# EAGLE design open-bldc-logic (EAGLE 6.2)
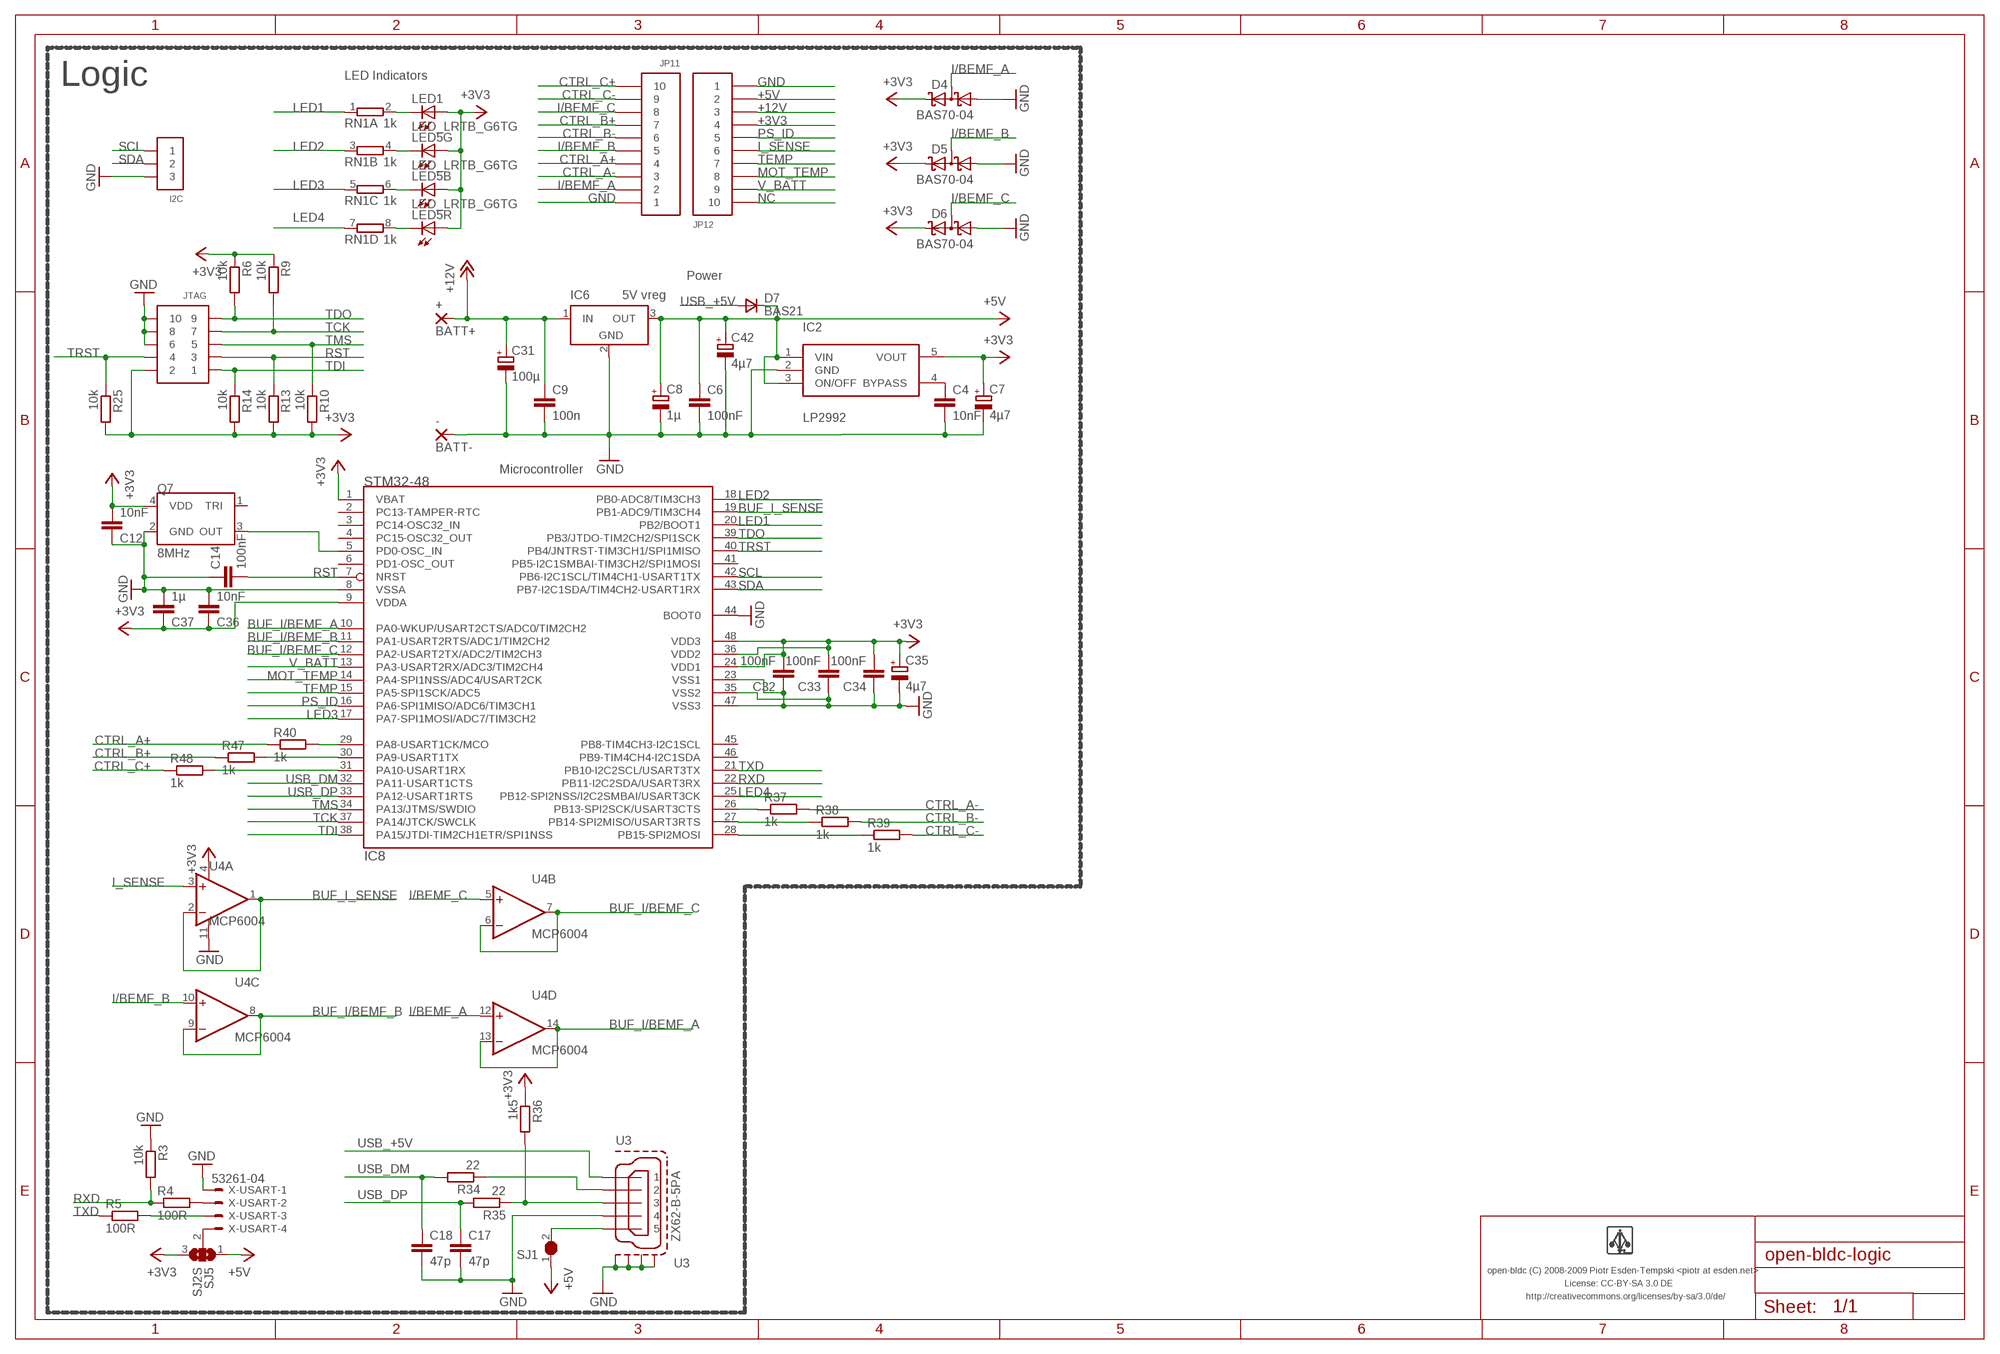
[diagram p0: schematic, sheet 1]

## Parts
+  BATT+  SMD5  [SMD2,54-5,08]
-  BATT-  SMD5  [SMD2,54-5,08]
C4  10nF  C-EUC0603  [C0603]
C6  100nF  C-EUC0603  [C0603]
C7  4µ7  CPOL-EUA/3216-18R  [A/3216-18R]
C8  1µ  CPOL-EUA/3216-18R  [A/3216-18R]
C9  100n  C-EUC0603  [C0603]
C12  10nF  C-EUC0603  [C0603]
C14  100nF  C-EUC0603  [C0603]
C17  47p  C-EUC0603  [C0603]
C18  47p  C-EUC0603  [C0603]
C31  100µ  CPOL-EUD/7343-31R  [D/7343-31R]
C32  100nF  C-EUC0603  [C0603]
C33  100nF  C-EUC0603  [C0603]
C34  100nF  C-EUC0603  [C0603]
C35  4µ7  CPOL-EUA/3216-18R  [A/3216-18R]
C36  10nF  C-EUC0603  [C0603]
C37  1µ  C-EUC0603  [C0603]
C42  4µ7  CPOL-EUA/3216-18R  [A/3216-18R]
D4  BAS70-04  [SOT23]
D5  BAS70-04  [SOT23]
D6  BAS70-04  [SOT23]
D7  BAS21  VAR2SOT23  [SOT-23]
I2C  PIN_HDR_EDG_1.27MM_3-1  [PIN_HDR_EDG_1.27MM_3-1]
IC2  LP2992  [SOT23-5]
IC6  5V vreg  LT1129CST5  [SOT223]
IC8  STM32-48  [LQFP48]
JP11  PIN_HDR_1.27MM_10  PIN_HDR_1.27MM_10_TH  [PIN_HDR_1.27MM_10]
JP12  PIN_HDR_1.27MM_10  PIN_HDR_1.27MM_10_TH  [PIN_HDR_1.27MM_10]
JTAG  PIN_HDR_EDG_1.27MM_5-2  [PIN_HDR_EDG_1.27MM_5-2]
LED1  AMBER  LEDCHIP-LED0603  [CHIP-LED0603]
LED5  LED_LRTB_G6TG  [PLCC6]
Q7  8MHz  ASE_ASCILLATOR  [ASE_OSCILLATOR]
R3  10k  R-EU_R0603  [R0603]
R4  100R  R-EU_R0603  [R0603]
R5  100R  R-EU_R0603  [R0603]
R6  10k  R-EU_R0603  [R0603]
R9  10k  R-EU_R0603  [R0603]
R10  10k  R-EU_R0603  [R0603]
R13  10k  R-EU_R0603  [R0603]
R14  10k  R-EU_R0603  [R0603]
R25  10k  R-EU_R0603  [R0603]
R34  22  R-EU_R0603  [R0603]
R35  22  R-EU_R0603  [R0603]
R36  1k5  R-EU_R0603  [R0603]
R37  1k  R-EU_R0603  [R0603]
R38  1k  R-EU_R0603  [R0603]
R39  1k  R-EU_R0603  [R0603]
R40  1k  R-EU_R0603  [R0603]
R47  1k  R-EU_R0603  [R0603]
R48  1k  R-EU_R0603  [R0603]
RN1  1k  R4N1206  [R4N1206]
SJ1  SJ1S  [SJ1S]
SJ5  SJ2S  [SJ2S]
U3  ZX62-B-5PA  [ZX62-B-5PA]
U4  MCP6004  [TSSOP_14]
X-USART  53261-04  [53261-04]

## Nets
+3V3: C7.+ C12.2 C32.2 C33.2 C34.2 C35.+ C36.1 C37.1 D4.2(C2) D5.2(C2) D6.2(C2) IC2.5(VOUT) IC8.1(VBAT) IC8.9(VDDA) IC8.24(VDD1) IC8.36(VDD2) IC8.48(VDD3) JP12.P$4 JTAG.P$2 LED1.A LED5.A1(R:A) LED5.A2(G:A) LED5.A3(B:A) Q7.4(VDD) R6.1 R9.1 R10.2 R13.2 R14.2 R25.2 R36.1 SJ5.3 U4.4(A:V+)
+5V: C6.1 C8.+ C42.+ D7.1(C) IC2.1(VIN) IC2.3(ON/OFF) IC6.3(OUT) JP12.P$2 SJ1.1 SJ5.1
+12V: +.1(P) C9.1 C31.+ IC6.1(IN) JP12.P$3
BUF_I/BEMF_A: IC8.10(PA0-WKUP/USART2CTS/ADC0/TIM2CH2) U4.13(D:-IN) U4.14(D:OUT)
BUF_I/BEMF_B: IC8.11(PA1-USART2RTS/ADC1/TIM2CH2) U4.8(C:OUT) U4.9(C:-IN)
BUF_I/BEMF_C: IC8.12(PA2-USART2TX/ADC2/TIM2CH3) U4.6(B:-IN) U4.7(B:OUT)
BUF_I_SENSE: IC8.19(PB1-ADC9/TIM3CH4) U4.1(A:OUT) U4.2(A:-IN)
CTRL_A+: JP11.P$4 R40.1
CTRL_A-: JP11.P$3 R37.2
CTRL_B+: JP11.P$7 R47.1
CTRL_B-: JP11.P$6 R38.2
CTRL_C+: JP11.P$10 R48.1
CTRL_C-: JP11.P$9 R39.2
GND: -.1(P) C4.2 C6.2 C7.- C8.- C9.2 C12.1 C14.1 C17.2 C18.2 C31.- C32.1 C33.1 C34.1 C35.- C36.2 C37.2 C42.- D4.1(A1) D5.1(A1) D6.1(A1) I2C.P$3 IC2.2(GND) IC6.2(GND) IC8.8(VSSA) IC8.23(VSS1) IC8.35(VSS2) IC8.44(BOOT0) IC8.47(VSS3) JP11.P$1 JP12.P$1 JTAG.P$6 JTAG.P$8 JTAG.P$10 Q7.2(GND) R3.1 U3.GND_LEFT(S1) U3.GND_RIGHT(S2) U3.GND_UP_LEFT(S3) U3.GND_UP_RIGHT(S4) U3.PIN_4 U4.11(A:V-) X-USART.1
I/BEMF_A: D4.3(C1A2) JP11.P$2 U4.12(D:+IN)
I/BEMF_B: D5.3(C1A2) JP11.P$5 U4.10(C:+IN)
I/BEMF_C: D6.3(C1A2) JP11.P$8 U4.5(B:+IN)
I_SENSE: JP12.P$6 U4.3(A:+IN)
LED1: IC8.20(PB2/BOOT1) RN1.1
LED2: IC8.18(PB0-ADC8/TIM3CH3) RN1.3
LED3: IC8.17(PA7-SPI1MOSI/ADC7/TIM3CH2) RN1.5
LED4: IC8.25(PB12-SPI2NSS/I2C2SMBAI/USART3CK) RN1.7
MOT_TEMP: IC8.14(PA4-SPI1NSS/ADC4/USART2CK) JP12.P$8
N$1: IC8.29(PA8-USART1CK/MCO) R40.2
N$2: LED5.C1(R:C) RN1.8
N$3: LED1.C RN1.2
N$4: LED5.C3(B:C) RN1.6
N$5: LED5.C2(G:C) RN1.4
N$6: IC8.26(PB13-SPI2SCK/USART3CTS) R37.1
N$8: SJ5.2 X-USART.4
N$9: R4.2 X-USART.2
N$20: R5.2 X-USART.3
N$22: C4.1 IC2.4(BYPASS)
N$25: R34.1 U3.PIN_2
N$26: SJ1.2 U3.PIN_5
N$28: R35.1 R36.2 U3.PIN_3
N$36: IC8.27(PB14-SPI2MISO/USART3RTS) R38.1
N$39: IC8.28(PB15-SPI2MOSI) R39.1
N$40: IC8.5(PD0-OSC_IN) Q7.3(OUT)
N$42: IC8.30(PA9-USART1TX) R47.2
N$45: IC8.31(PA10-USART1RX) R48.2
NC: JP12.P$10
PS_ID: IC8.16(PA6-SPI1MISO/ADC6/TIM3CH1) JP12.P$5
RST: C14.2 IC8.7(NRST) JTAG.P$3 R13.1
RXD: IC8.22(PB11-I2C2SDA/USART3RX) R3.2 R4.1
SCL: I2C.P$1 IC8.42(PB6-I2C1SCL/TIM4CH1-USART1TX)
SDA: I2C.P$2 IC8.43(PB7-I2C1SDA/TIM4CH2-USART1RX)
TCK: IC8.37(PA14/JTCK/SWCLK) JTAG.P$7 R9.2
TDI: IC8.38(PA15/JTDI-TIM2CH1ETR/SPI1NSS) JTAG.P$1 R14.1
TDO: IC8.39(PB3/JTDO-TIM2CH2/SPI1SCK) JTAG.P$9 R6.2
TEMP: IC8.15(PA5-SPI1SCK/ADC5) JP12.P$7
TMS: IC8.34(PA13/JTMS/SWDIO) JTAG.P$5 R10.1
TRST: IC8.40(PB4/JNTRST-TIM3CH1/SPI1MISO) JTAG.P$4 R25.1
TXD: IC8.21(PB10-I2C2SCL/USART3TX) R5.1
USB_+5V: D7.3(A) U3.PIN_1
USB_DM: C18.1 IC8.32(PA11-USART1CTS) R34.2
USB_DP: C17.1 IC8.33(PA12-USART1RTS) R35.2
V_BATT: IC8.13(PA3-USART2RX/ADC3/TIM2CH4) JP12.P$9
Unconnected: IC8.2(PC13-TAMPER-RTC) IC8.3(PC14-OSC32_IN) IC8.4(PC15-OSC32_OUT) IC8.6(PD1-OSC_OUT) IC8.41(PB5-I2C1SMBAI-TIM3CH2/SPI1MOSI) IC8.45(PB8-TIM4CH3-I2C1SCL) IC8.46(PB9-TIM4CH4-I2C1SDA) Q7.1(TRI)

## Notes on the sheet
- LED Indicators
- Logic
- Power
- Microcontroller
- open-bldc (C) 2008-2009 Piotr Esden-Tempski <piotr at esden.net>
- License: CC-BY-SA 3.0 DE
- http://creativecommons.org/licenses/by-sa/3.0/de/

## Power pins joined to a net without a drawn wire
GND: IC6.4(GND)

## Library data of the parts
+ - = wirepad:SMD5: SMD PAD
C4 C6 C9 C12 C14 C17 C18 C32-C34 C36 C37 = rcl:C-EU: CAPACITOR, European symbol
C7 C8 C31 C35 C42 = rcl:CPOL-EU: POLARIZED CAPACITOR, European symbol
D4-D6 = diode:BAS70-04: Silicon Schottky Diodes General-purpose diode for high-speed switching
D7 = zetex:VAR2SOT23: DIODE
I2C = open-bldc:PIN_HDR_EDG_1.27MM_3-1
IC2 = open-bldc:LP2992
IC6 = linear-technology:LT1129CST5: VOLTAGE REGULATOR with shutdown
IC8 = open-bldc:STM32-48
JP11 JP12 = open-bldc:PIN_HDR_1.27MM_10
JTAG = open-bldc:PIN_HDR_EDG_1.27MM_5-2
LED1 = led:LED: LED OSRAM: - CHIPLED LG R971, LG N971, LY N971, LG Q971, LY Q971, LO R971, LY R971 LH N974, LH R974 LS Q976, LO Q976, LY Q976 LO Q996 - Hyper CHIPLED LW Q18S LB Q993, LB Q99A, LB R99A - SideLED LS A670, LO A670, LY A670, LG A670, LP A670 LB A673, LV A673, LT A673, LW A673 LH A674 LY A675 LS A676, LA A676, LO A676, LY A676, LW A676 LS A679, LY A679, LG A679 - Hyper Micro SIDELED® LS Y876, LA Y876, LO Y876, LY Y876 LT Y87S - SmartLED LW L88C, LW L88S LB L89C, LB L89S, LG L890 LS L89K, LO L89K, LY L89K LS L896, LA L896, LO L896, LY L896 - TOPLED LS T670, LO T670, LY T670, LG T670, LP T670 LSG T670, LSP T670, LSY T670, LOP T670, LYG T670 LG T671, LOG T671, LSG T671 LB T673, LV T673, LT T673, LW T673 LH T674 LS T676, LA T676, LO T676, LY T676, LB T676, LH T676, LSB T676, LW T676 LB T67C, LV T67C, LT T67C, LS T67K, LO T67K, LY T67K, LW E67C LS E67B, LA E67B, LO E67B, LY E67B, LB E67C, LV E67C, LT E67C LW T67C LS T679, LY T679, LG T679 LS T770, LO T770, LY T770, LG T770, LP T770 LB T773, LV T773, LT T773, LW T773 LH T774 LS E675, LA E675, LY E675, LS T675 LS T776, LA T776, LO T776, LY T776, LB T776 LHGB T686 LT T68C, LB T68C - Hyper Mini TOPLED® LB M676 - Mini TOPLED Santana® LG M470 LS M47K, LO M47K, LY M47K Source: http://www.osram.convergy.de LUXEON: - LUMILED® LXK2-PW12-R00, LXK2-PW12-S00, LXK2-PW14-U00, LXK2-PW14-V00 LXK2-PM12-R00, LXK2-PM12-S00, LXK2-PM14-U00 LXK2-PE12-Q00, LXK2-PE12-R00, LXK2-PE12-S00, LXK2-PE14-T00, LXK2-PE14-U00 LXK2-PB12-K00, LXK2-PB12-L00, LXK2-PB12-M00, LXK2-PB14-N00, LXK2-PB14-P00, LXK2-PB14-Q00 LXK2-PR12-L00, LXK2-PR12-M00, LXK2-PR14-Q00, LXK2-PR14-R00 LXK2-PD12-Q00, LXK2-PD12-R00, LXK2-PD12-S00 LXK2-PH12-R00, LXK2-PH12-S00 LXK2-PL12-P00, LXK2-PL12-Q00, LXK2-PL12-R00 Source: www.luxeon.com KINGBRIGHT: KA-3528ASYC Source: www.kingbright.com
LED5 = open-bldc:LED_LRTB_G6TG
Q7 = open-bldc:ASE_ASCILLATOR
R3-R6 R9 R10 R13 R14 R25 R34-R40 R47 R48 = rcl:R-EU_: RESISTOR, European symbol
RN1 = open-bldc:R4N1206
SJ1 = open-bldc:SJ1S
SJ5 = open-bldc:SJ2S
U3 = open-bldc:ZX62-B-5PA
U4 = open-bldc:MCP6004
X-USART = con-molex:53?-04: CONNECTOR wire to board 1.25 mm (.049 inch) pitch header

## Net classes
0 default: width 0.152 mm, drill 0.305 mm, clearance 0.152 mm

## Board
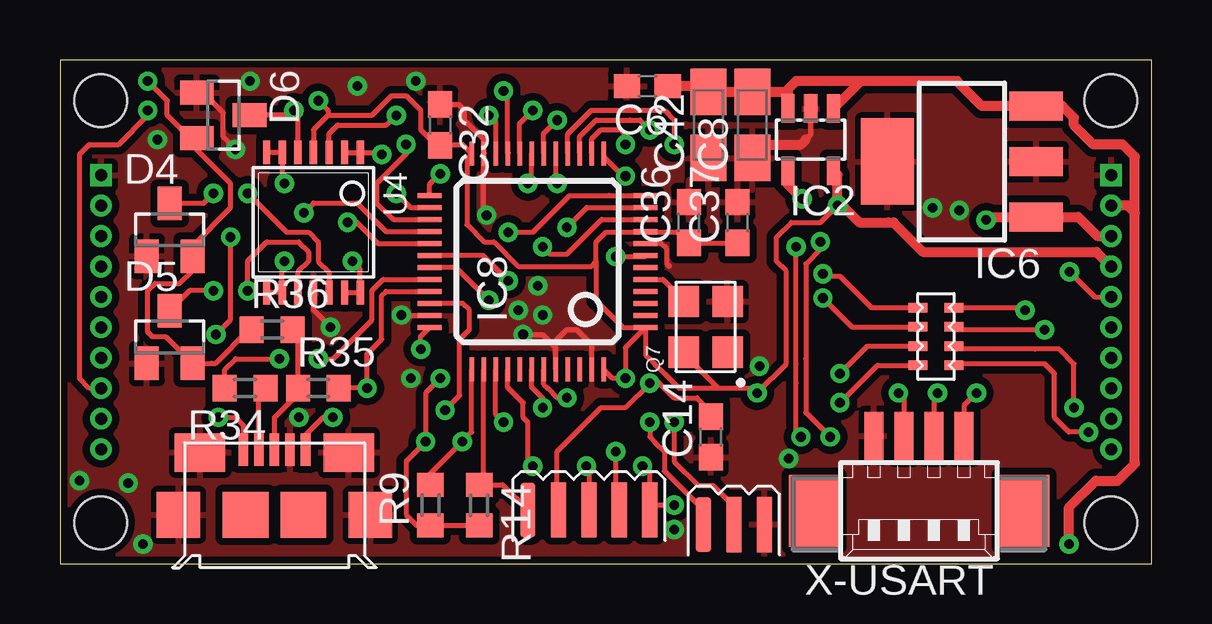
[diagram p1: board, top side]
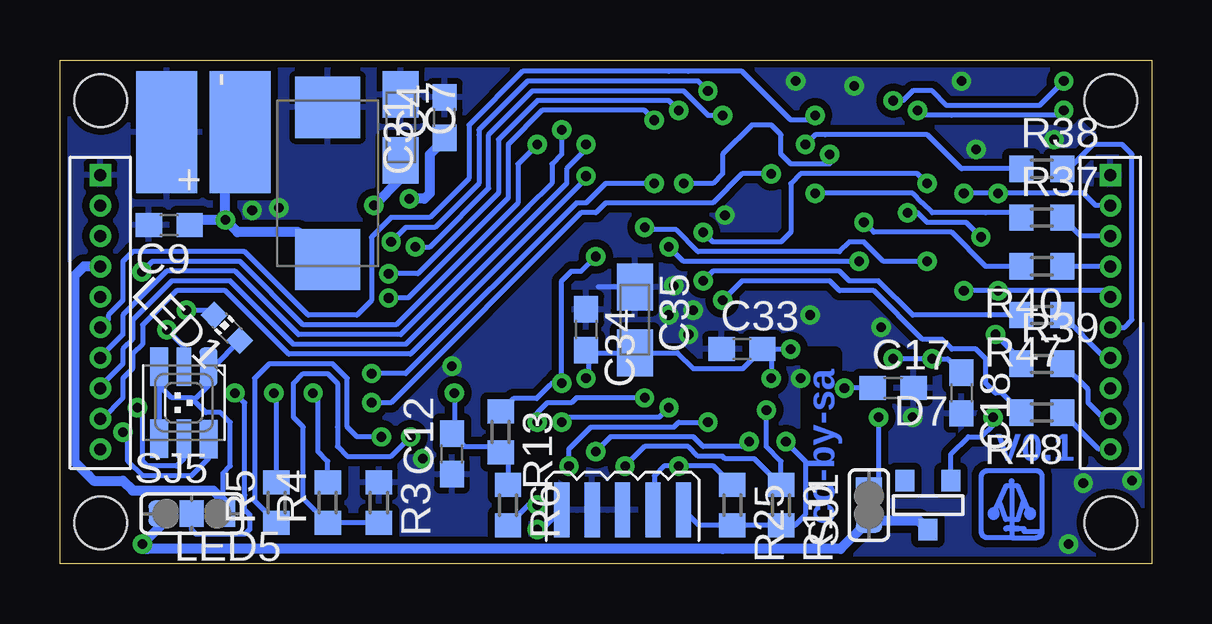
[diagram p2: board, bottom side, seen from below]

Size 45.5 x 21 mm. Coordinates in mm from the lower left corner, seen from the top.
Outline: 0,0 45.5,0 45.5,21 0,21 0,0
Copper layers (1*16): Top 0.035mm / dielectric 1.5mm / Bottom 0.035mm
Design rules: minimum track width 7mil, minimum drill 0.3mm, track to track 8mil, track to pad 8mil, pad to pad 8mil, via to via 8mil, smd to smd 8mil, copper to edge 10mil, drill to drill 8mil, minimum pad ring 8mil, minimum via ring 8mil, stop-mask expansion 4mil, vias tented up to drill 0.4mm, thermal gap 10mil
Holes 2.2 mm at 1.7,1.7 43.8,1.7 43.8,19.3 1.7,19.3

### Footprints (pad centres in the part's own frame; a part is rotated, then mirrored left to right if it is on the bottom)
SMD2,54-5,08 = smd 2.54 x 5.08: 1 0,0
C0603 = smd 1.1 x 1: 1 -0.85,0; 2 0.85,0
A/3216-18R = smd 1.95 x 1.5: + 1.375,0; - -1.375,0
D/7343-31R = smd 2.55 x 2.7: + 3.175,0; - -3.175,0
SOT23 = smd 1 x 1.4: 1 -0.95,-1.1; 2 0.95,-1.1; 3 0,1.1
SOT-23 = smd 0.787 x 0.889: 1 0.025,-1.016; 2 -0.94,1.016; 3 0.991,1.016
PIN_HDR_EDG_1.27MM_3-1 = smd 2.3 x 0.635: P$1 0,0; P$2 0,1.27; P$3 0,2.54
SOT23-5 = smd 0.55 x 1.2: 1 -0.95,-1.3; 2 0,-1.3; 3 0.95,-1.3; 4 0.95,1.3; 5 -0.95,1.3
SOT223 = smd 1.219 x 2.235: 1 -2.311,-3.099; 2 0,-3.099; 3 2.311,-3.099 | smd 3.6 x 2.2: 4 0,3.099
LQFP48 = smd 0.2 x 1: 1 -2.75,-4.5; 2 -2.25,-4.5; 3 -1.75,-4.5; 4 -1.25,-4.5; 5 -0.75,-4.5; 6 -0.25,-4.5; 7 0.25,-4.5; 8 0.75,-4.5; 9 1.25,-4.5; 10 1.75,-4.5; 11 2.25,-4.5; 12 2.75,-4.5; 25 2.75,4.5; 26 2.25,4.5; 27 1.75,4.5; 28 1.25,4.5; 29 0.75,4.5; 30 0.25,4.5; 31 -0.25,4.5; 32 -0.75,4.5; 33 -1.25,4.5; 34 -1.75,4.5; 35 -2.25,4.5; 36 -2.75,4.5 | smd 1 x 0.2: 13 4.5,-2.75; 14 4.5,-2.25; 15 4.5,-1.75; 16 4.5,-1.25; 17 4.5,-0.75; 18 4.5,-0.25; 19 4.5,0.25; 20 4.5,0.75; 21 4.5,1.25; 22 4.5,1.75; 23 4.5,2.25; 24 4.5,2.75; 37 -4.5,2.75; 38 -4.5,2.25; 39 -4.5,1.75; 40 -4.5,1.25; 41 -4.5,0.75; 42 -4.5,0.25; 43 -4.5,-0.25; 44 -4.5,-0.75; 45 -4.5,-1.25; 46 -4.5,-1.75; 47 -4.5,-2.25; 48 -4.5,-2.75
PIN_HDR_1.27MM_10 = drill 0.5 square: P$1 0,0 | drill 0.5: P$2 0,1.27; P$3 0,2.54; P$4 0,3.81; P$5 0,5.08; P$6 0,6.35; P$7 0,7.62; P$8 0,8.89; P$9 0,10.16; P$10 0,11.43
PIN_HDR_EDG_1.27MM_5-2 = smd 2.3 x 0.635: P$1 0,0; P$3 0,1.27; P$5 0,2.54; P$7 0,3.81; P$9 0,5.08 | smd 2.3 x 0.635 bottom: P$2 0,0; P$4 0,1.27; P$6 0,2.54; P$8 0,3.81; P$10 0,5.08
CHIP-LED0603 = smd 0.8 x 0.8: A 0,-0.75; C 0,0.75
PLCC6 = smd 0.75 x 1.6: A1 -1.025,-1.5; A2 1.025,-1.5; A3 1.025,1.5; C1 -1.025,1.525 | smd 0.6 x 1.6: C2 0,-1.5; C3 0,1.5
ASE_OSCILLATOR = smd 1.295 x 1.27: 1 -1.041,-0.902; 2 1.067,-0.902; 3 1.067,0.927; 4 -1.041,0.927
R0603 = smd 1 x 1.1: 1 -0.85,0; 2 0.85,0
R4N1206 = smd 0.4 x 0.8: 1 0,0; 2 0,1.5; 3 0.8,0; 4 0.8,1.5; 5 1.6,0; 6 1.6,1.5; 7 2.4,0; 8 2.4,1.5
SJ1S = smd 1 x 1.1: 1 -0.65,-0.005; 2 0.65,-0.005
SJ2S = smd 1 x 1.1: 1 -1.3,0; 2 0,0; 3 1.3,0
ZX62-B-5PA = smd 1.8 x 1.9: GND_LEFT -4,0; GND_RIGHT 4,0 | smd 1.9 x 1.9: GND_MID_LEFT -1.2,0; GND_MID_RIGHT 1.2,0 | smd 2.1 x 1.6: GND_UP_LEFT -3.1,2.6; GND_UP_RIGHT 3.1,2.6 | smd 0.4 x 1.35: PIN_1 -1.3,2.725; PIN_2 -0.65,2.725; PIN_3 0,2.725; PIN_4 0.65,2.725; PIN_5 1.3,2.725
TSSOP_14 = smd 0.305 x 0.991: 1 -1.95,-2.918; 2 -1.3,-2.918; 3 -0.65,-2.918; 4 0,-2.918; 5 0.65,-2.918; 6 1.3,-2.918; 7 1.95,-2.918; 8 1.95,2.918; 9 1.3,2.918; 10 0.65,2.918; 11 0,2.918; 12 -0.65,2.918; 13 -1.3,2.918; 14 -1.95,2.918
53261-04 = smd 0.8 x 2: 1 1.875,-2.5; 2 0.625,-2.5; 3 -0.625,-2.5; 4 -1.875,-2.5 | smd 2.1 x 3: S1 4.375,0.625; S2 -4.375,0.625

### Placement (x,y rotation side)
+  38,17.98 0 bottom
-  41.05,17.98 180 bottom
C4  29.46,18.59 90 bottom
C6  24.49,19.91 180 top
C7  31.29,18.19 270 bottom
C8  28.85,18.29 90 top
C9  40.94,14.12 180 bottom
C12  29.16,4.57 90 bottom
C14  27.13,5.28 90 top
C17  10.77,7.32 0 bottom
C18  7.92,7.11 270 bottom
C31  34.34,15.85 270 bottom
C32  15.85,18.29 270 top
C33  17.07,8.94 0 bottom
C34  23.57,9.75 270 bottom
C35  21.54,10.16 270 bottom
C36  26.21,14.22 90 top
C37  28.24,14.22 90 top
C42  27.03,18.29 90 top
D4  4.57,13.92 0 top
D5  4.57,9.45 0 top
D6  6.81,18.69 270 top
D7  9.35,2.44 0 bottom
I2C  26.82,1.63 270 top
IC2  31.29,17.68 180 top
IC6  37.59,16.76 90 top
IC8  19.91,12.6 90 top
JP11  1.71,16.2 180 bottom
JP12  43.81,16.2 180 bottom
JTAG  19.51,2.24 270 top
LED1  38.54,9.83 45 bottom
LED5  40.34,6.71 180 bottom
Q7  26.92,9.86 90 top
R3  32.21,2.54 270 bottom
R4  34.34,2.54 90 bottom
R5  36.47,2.54 90 bottom
R6  26.82,2.44 270 bottom
R9  15.44,2.44 90 top
R10  15.44,2.44 270 bottom
R13  27.13,5.49 270 bottom
R14  17.48,2.44 270 top
R25  17.48,2.44 270 bottom
R34  7.72,7.32 180 top
R35  10.77,7.32 0 top
R36  8.84,9.75 0 top
R37  4.57,14.43 0 bottom
R38  4.57,16.46 0 bottom
R39  4.57,8.33 0 bottom
R40  4.57,12.4 180 bottom
R47  4.57,10.36 180 bottom
R48  4.57,6.3 180 bottom
RN1  35.76,10.67 270 top
SJ1  11.79,2.44 90 bottom
SJ5  40.01,2.08 0 bottom
U3  8.94,2.03 0 top
U4  10.57,14.22 180 top
X-USART  35.81,2.83 180 top

### Tracks (layer width: path | path; a pad name or v marks a point on that pad's centre or on a via)
+3V3  (via drill 0.4)
  Top 0.203: IC8.48 23.04,7.72 v23.57,7.72 23.57,9.01 IC8.1 | v15.04,8.94 15.04,9.47 IC8.36 | IC8.1 24.41,8.71 24.59,8.53 24.79,8.33 25.2,7.92 25.4,7.72 25.81,7.32 27.43,7.32 | 27.43,7.32 28.85,7.32 v29.06,7.11 30.28,8.33 30.28,12.19 29.87,12.6 29.87,13.61 30.48,14.22 31.7,14.22 v32.41,14.94 | U4.4 10.57,18.09 11.18,18.69 | 11.18,18.69 13.01,18.69 13.82,19.51 14.43,19.51 15.04,18.9 15.04,18.09 15.68,17.44 C32.2 15.89,17.48 16.79,17.48 IC8.24 16.96,16.89 16.96,14.13 17.68,13.41 18.09,13.41 19.1,12.39 22.15,12.39 22.35,12.6 | v15.85,7.72 15.24,7.11 15.24,5.49 v15.24,5.08 14.43,4.27 14.43,2.03 14.87,1.59 R10.2 R25.2 | 27.43,7.32 26.4,8.34 26.4,8.41 Q7.4 | IC8.1 23.48,9.85 22.35,10.97 22.35,12.6 | 22.35,12.6 22.35,13.41 22.76,13.82 24.38,13.82 | 24.38,13.82 IC8.9 24.38,13.82 | v3.66,20.12 4.47,19.3 4.47,18.69 5.42,17.74 D6.2 5.71,17.25 5.89,17.07 7.11,15.85 7.11,14.83 5.52,13.24 D4.2 5.52,12.23 4.98,11.68 3.96,11.68 3.66,11.38 3.66,9.65 3.86,9.45 4.42,9.45 D5.2 6.32,8.35 6.48,8.35 7.89,9.75 R36.1 | v10.77,19.3 11.18,18.9 11.18,18.69 | 24.38,13.82 25.77,13.82 C36.1 C37.1
  Top 0.406: IC2.5 32.41,16.21 v32.41,14.94 32.61,14.94 33.33,14.22 34.54,14.22 34.75,14.22 35.97,13 43.2,13 JP12.P$4
  Bottom 0.203: JTAG.P$2 18.86,1.59 R25.2 R10.2 | 23.45,8.79 C34.2 | 23.45,8.79 C35.+ 19.76,8.79 19.1,8.13 17.03,8.13 C33.2 | 23.45,8.79 23.45,7.84 v23.57,7.72 | R10.2 15.07,1.22 | C33.2 v15.04,8.94 | v29.06,7.11 29.06,5.93 29.16,5.83 C12.2 28.65,4.91 28.65,4.88 27.94,4.88 27.37,4.88 R13.2 26.82,4.33 R6.1 27.13,3.59 | v15.24,5.08 14.43,4.27 14.43,2.03 14.87,1.59 R10.2 | C33.2 16.05,8.78 | v15.85,7.72 15.85,8.57 C33.2 | LED1.A 39.09,8.21 LED5.A1 39.31,7.43 39.83,6.91 40.03,6.91 | LED5.A3 LED5.A2 41.36,7.43 40.84,6.91 40.03,6.91 | 40.03,6.91 39.42,6.3 38.81,6.3 38.41,5.89 38.41,4.06 38.7,3.76 38.7,2.64 | v3.66,20.12 4.67,19.1 8.53,19.1 9.14,19.71 9.96,19.71 10.36,19.3 v10.77,19.3
  Bottom 0.406: C7.+ 31.29,16.05 v32.41,14.94 | JP12.P$4 44.51,12.39 44.91,11.99 44.91,4.27 44.3,3.66 44.09,3.45 42.88,3.45 42.47,3.05 39.11,3.05 38.7,2.64 SJ5.3
+5V  (via drill 0.4)
  Top 0.406: 33.73,20.12 37.39,20.12 38.43,19.07 IC6.3 41.78,19.07 42.27,18.59 42.27,18.29 43.08,17.48 44.3,17.48 44.81,16.97 44.81,14.63 | 33.73,20.12 33.38,20.12 IC2.1 | 30.34,19.78 IC2.3 | 30.34,19.78 30.68,20.12 33.73,20.12 | 44.81,14.63 44.5,14.94 44.5,14.93 JP12.P$2 | 44.81,14.63 44.81,4.17 44.3,3.66 44.09,3.45 43.18,3.45 42.06,2.34 v42.06,0.81 | C42.+ 26.64,20.05 | C6.1 26.77,19.91 C42.+ | C42.+ C8.+ 30.23,19.66 30.34,19.78
  Bottom 0.406: SJ5.1 41.3,1.57 v42.06,0.81 arc-90 41.86,0.61 17.88,0.61 12.96,0.61 SJ1.1 9.69,1.79 D7.1
+12V  (via drill 0.4)
  Top 0.406: JP12.P$3 43.24,13.66 42.44,14.45 IC6.1 38.73,14.45 v38.61,14.33
  Bottom 0.406: v38.61,14.33 38.1,13.82 35.56,13.82 34.42,12.68 C31.+ | v38.61,14.33 39.89,14.33 C9.1 | +.1 38.61,17.37 v38.61,14.33
BUF_I/BEMF_A  (via drill 0.4)
  Top 0.203: U4.13 U4.14 12.52,12.27 v12.19,12.6 | v20.12,13.21 20.42,12.9 21.13,12.9 22.58,14.35 IC8.10
  Bottom 0.203: v12.19,12.6 19.51,12.6 v20.12,13.21
BUF_I/BEMF_B  (via drill 0.4)
  Top 0.203: U4.8 U4.9 9.27,12.6 v9.35,12.6 | v21.13,14.02 21.96,14.85 IC8.11
  Bottom 0.203: v9.35,12.6 11.18,12.6 11.99,13.41 12.6,13.41 13.01,13.01 18.9,13.01 19.81,13.92 21.03,13.92 v21.13,14.02
BUF_I/BEMF_C  (via drill 0.4)
  Top 0.203: U4.7 U4.6 9.27,15.93 v9.35,15.85 | v18.69,13.82 19.71,13.82 21.23,15.34 22.86,15.34 22.87,15.35 IC8.12
  Bottom 0.203: v18.69,13.82 18.29,13.41 15.44,13.41 15.04,13.82 15.04,15.85 14.63,16.26 9.75,16.26 v9.35,15.85
BUF_I_SENSE  (via drill 0.4)
  Top 0.203: U4.2 U4.1 13.34,17.14 v13.41,17.07 | v19.51,15.85 19.66,16.01 IC8.19
  Bottom 0.203: v13.41,17.07 13.41,16.66 15.04,16.66 15.44,17.07 15.44,17.88 15.85,18.29 16.66,18.29 17.88,17.07 17.88,16.26 18.29,15.85 v19.51,15.85
CTRL_A+
  Bottom 0.203: JP11.P$4 R40.1
CTRL_A-
  Bottom 0.203: JP11.P$3 2.96,13.66 R37.2
CTRL_B+
  Bottom 0.203: JP11.P$7 1.94,8.58 R47.1
CTRL_B-
  Bottom 0.203: JP11.P$6 1.12,9.85 0.81,10.16 0.81,17.07 1.22,17.48 2.44,17.48 3.45,16.46 R38.2
CTRL_C+
  Bottom 0.203: JP11.P$10 2.19,4.77 R48.1
CTRL_C-
  Bottom 0.203: JP11.P$9 1.98,6.04 2.64,6.71 2.64,7.25 R39.2
GND  (via drill 0.4)
  Top 0.203: IC8.8 25.06,13.35 25.3,13.11 25.3,12.5 25.4,12.39 | IC8.23 17.68,17.1 | v19.3,9.55 20.12,9.55 20.66,9 IC8.44 20.66,9.28 21.13,9.75 21.54,9.75 22.16,9.13 IC8.47 | 31.09,17.68 31.29,17.88 IC2.2 | IC8.23 17.66,14.64 v17.78,14.53 | D6.1 5.96,19.64 6.81,18.8 6.81,17.78 v7.32,17.27 | C32.1 16.62,19.14 16.87,18.9 16.87,18.49 17.66,17.69 IC8.23 | IC8.35 14.24,10.35 v14.22,10.36 | v11.28,9.86 10.57,10.57 U4.11
  Top 0.406: 31.09,17.68 30.91,17.5 | C8.- 29.42,17.48 30.89,17.48
  Bottom 0.203: C35.- 23.06,11.54 | JTAG.P$10 25.4,1.42 v25.6,1.42
  other vias: 9.96,6.1 37.49,14.73 36.37,14.83 19.91,11.58 30.38,4.37 2.84,3.35 29.16,8.23 12.4,19.91 7.92,20.12 14.83,20.12 19.1,10.57 20.12,10.36 14.63,7.72 0.81,3.45 3.45,0.81 4.06,17.68
  pour Top (isolate 0.305): 45.21,20.88 0.1,20.85 0.1,0 45.21,0
  pour Bottom (isolate 0.305): 45.21,20.88 0.1,20.85 0.1,0 45.21,0
I/BEMF_A  (via drill 0.4)
  Top 0.203: U4.12 11.22,12.15 10.77,12.6 10.77,13.41 10.36,13.82 9.45,13.82 8.13,15.14 v7.82,15.44 | D4.3 5.98,15.02 v6.4,15.44
  Bottom 0.203: JP11.P$2 2.33,14.93 2.85,15.44 v6.4,15.44 6.5,15.44 v7.82,15.44
I/BEMF_B  (via drill 0.4)
  Top 0.203: U4.10 9.92,12.15 10.36,12.6 10.36,13.01 9.96,13.41 8.62,13.41 7.82,12.62 v7.82,11.38 | D5.3 5.4,11.38 v6.4,11.38
  Bottom 0.203: v7.82,11.38 v6.4,11.38 1.97,11.38 JP11.P$5
I/BEMF_C  (via drill 0.4)
  Top 0.203: JP11.P$8 1.22,7.31 0.81,7.72 0.81,17.07 1.22,17.48 2.44,17.48 3.66,18.69 v3.66,18.9 | U4.5 9.92,18.73 v9.75,18.9 9.55,18.69 D6.3
  Bottom 0.203: v3.66,18.9 3.66,18.69 8.33,18.69 9.55,18.69 v9.75,18.9
I_SENSE  (via drill 0.4)
  Top 0.203: U4.3 11.22,17.92 11.58,18.29 13.61,18.29 v14.02,18.69
  Bottom 0.203: JP12.P$6 43.48,10.18 43.48,10.36 42.88,10.97 42.88,12.6 42.47,13.01 37.8,13.01 35.15,10.36 33.12,10.36 32.51,10.97 32.51,13.61 31.7,14.43 30.07,14.43 28.45,16.05 28.45,18.29 26.21,20.52 20.12,20.52 19.3,20.52 17.07,20.52 15.04,18.49 14.22,18.49 v14.02,18.69
LED1  (via drill 0.4)
  Top 0.203: v19.71,18.9 19.16,18.35 IC8.20 | RN1.1 33.83,10.67 32.51,11.99 31.9,11.99 v31.8,12.09
  Bottom 0.203: v31.8,12.09 30.58,12.09 27.23,15.44 27.23,17.68 25.6,19.3 20.12,19.3 v19.71,18.9
LED2  (via drill 0.4)
  Top 0.203: v20.73,18.49 20.16,17.93 IC8.18 | RN1.3 33.01,9.87 v31.8,11.07
  Bottom 0.203: v31.8,11.07 30.99,11.07 26.82,15.24 26.82,17.48 25.4,18.9 21.13,18.9 v20.73,18.49
LED3  (via drill 0.4)
  Top 0.203: v20.73,15.85 20.66,15.91 IC8.17 | RN1.5 33.66,9.07 v32.51,7.92
  Bottom 0.203: v32.51,7.92 31.09,7.92 23.98,15.04 23.57,15.04 22.76,15.85 v20.73,15.85
LED4  (via drill 0.4)
  Top 0.203: v15.85,16.26 15.41,15.82 IC8.25 | RN1.7 34.07,8.27 v32.51,6.71
  Bottom 0.203: v32.51,6.71 31.7,6.71 23.77,14.63 23.16,14.63 22.76,15.04 18.29,15.04 17.07,16.26 v15.85,16.26
LOGO1
  Bottom 0.203: 5.83,1.08 6.84,1.08 arc90 7.1,1.33 7.1,3.62 arc90 6.84,3.87 4.81,3.87 arc90 4.56,3.62 4.56,1.33 | 5.83,1.08 4.81,1.08 arc-90 4.56,1.33 | 6.59,2.1 6.08,3.24 5.83,3.24 | 5.83,3.24 5.57,3.24 5.07,2.1 | 6.33,2.6 6.08,1.84 5.83,1.84 | 5.83,1.84 5.57,1.84 5.32,2.63 | 4.56,1.33 5.32,1.33 5.32,1.46 5.57,1.46 5.83,1.44 5.83,1.46 | 5.83,3.24 5.83,1.84 | 5.83,1.84 5.83,1.46 | 5.83,1.46 5.83,1.08 | 5.83,3.24 5.83,3.42
  Bottom 0.254: 5.57,1.46 5.83,1.46 6.05,1.46 | 5.83,3.42 5.83,3.44
  Bottom 0.508: 5.07,2.07 5.07,2.1 | 6.59,2.1 6.59,2.07
MOT_TEMP  (via drill 0.4)
  Top 0.203: v23.57,17.48 23.57,17.88 23.37,18.09 22.55,18.09 22.16,17.69 IC8.14
  Bottom 0.203: JP12.P$8 43.81,7.39 42.88,8.33 42.88,8.94 42.47,9.35 42.47,10.16 40.84,11.79 38.41,11.79 35.76,9.14 31.09,9.14 25.6,14.63 24.38,15.85 24.38,16.46 23.57,17.27 v23.57,17.48
N$1  (via drill 0.4)
  Top 0.203: v11.99,14.22 12.39,14.22 13.27,13.35 IC8.29
  Bottom 0.203: R40.2 6.91,12.39 8.33,13.82 11.58,13.82 v11.99,14.22
N$2  (via drill 0.4)
  Top 0.203: v42.88,5.49 42.06,5.49 41.45,6.1 41.45,7.92 41.05,8.33 37.33,8.33 RN1.8
  Bottom 0.203: LED5.C1 39.31,4.38 40.03,3.66 42.06,3.66 42.67,4.27 42.67,5.28 v42.88,5.49
N$3  (via drill 0.4)
  Top 0.203: RN1.2 40.13,10.67 v40.23,10.57
  Bottom 0.203: LED1.C 39.28,10.57 v40.23,10.57
N$4  (via drill 0.4)
  Top 0.203: v42.27,6.5 42.27,8.33 41.66,8.94 40.64,8.94 37.39,8.94 RN1.6
  Bottom 0.203: LED5.C3 40.34,4.37 40.64,4.06 41.86,4.06 42.06,4.27 42.06,6.3 v42.27,6.5
N$5  (via drill 0.4)
  Top 0.203: v41.05,9.75 37.38,9.75 RN1.4
  Bottom 0.203: LED5.C2 40.34,9.04 v41.05,9.75
N$6  (via drill 0.4)
  Top 0.203: v14.02,15.44 14.62,14.85 IC8.26
  Bottom 0.203: v14.02,15.44 9.96,15.44 9.55,15.04 9.14,14.63 6.91,14.63 5.62,14.63 R37.1
N$8  (via drill 0.4)
  Top 0.203: v38.2,7.11 37.68,6.59 X-USART.4
  Bottom 0.203: v38.2,7.11 37.8,6.71 37.8,2.85 37.8,2.23 37.59,2.03 37.59,1.42 37.8,1.22 39.83,1.22 40.01,1.4 SJ5.2
N$9  (via drill 0.4)
  Top 0.203: v34.95,7.11 35.18,6.88 X-USART.2
  Bottom 0.203: R4.2 34.34,4.27 34.75,4.67 34.75,6.91 v34.95,7.11
N$20  (via drill 0.4)
  Top 0.203: X-USART.3 36.43,6.97 v36.58,7.11
  Bottom 0.203: 36.58,3.29 R5.2 36.47,7.01 v36.58,7.11
N$22  (via drill 0.4)
  Top 0.406: IC2.4 30.34,15.81 v30.94,15.21
  Bottom 0.406: C4.1 29.46,17.68 30.07,17.07 30.07,15.44 30.3,15.21 v30.94,15.21
N$25
  Top 0.203: R34.1 8.29,7.03 U3.PIN_2
N$26  (via drill 0.4)
  Top 0.203: U3.PIN_5 10.24,5.36 10.97,6.1 v11.38,6.1
  Bottom 0.203: v11.38,6.1 11.38,3.49 SJ1.2
N$28
  Top 0.203: U3.PIN_3 8.94,6.1 9.92,7.08 R35.1 9.92,9.52 R36.2
N$36  (via drill 0.4)
  Top 0.203: v14.43,17.48 14.43,17.07 13.21,15.85 13.21,15.04 13.82,14.43 13.9,14.35 IC8.27
  Bottom 0.203: v14.43,17.48 14.02,17.88 13.61,17.88 9.35,17.88 7.92,16.46 R38.1
N$39  (via drill 0.4)
  Top 0.203: v6.5,9.55 7.11,10.16 v7.11,13.61 | v10.16,14.63 10.57,15.04 12.39,15.04 13.58,13.85 IC8.28
  Bottom 0.203: v7.11,13.61 7.72,14.22 9.35,14.22 9.75,14.63 v10.16,14.63 | v6.5,9.55 5.42,8.47 R39.1
N$40
  Top 0.203: Q7.3 26.06,10.92 25.2,11.79 25.13,11.85 IC8.5
N$42  (via drill 0.4)
  Top 0.203: v18.69,11.79 17.63,12.85 IC8.30
  Bottom 0.203: v18.69,11.79 18.29,12.19 13.01,12.19 12.6,11.79 11.38,11.79 9.96,10.36 R47.2
N$45  (via drill 0.4)
  Top 0.203: v17.88,10.97 16.51,12.35 IC8.31
  Bottom 0.203: R48.2 6.24,7.11 6.5,7.11 6.91,7.52 6.91,8.53 7.32,8.94 8.33,8.94 8.74,9.35 9.55,9.35 11.58,11.38 13.01,11.38 13.41,11.79 17.07,11.79 v17.88,10.97
PS_ID  (via drill 0.4)
  Top 0.203: v25.6,17.48 25.6,18.49 25.2,18.9 22.15,18.9 21.16,17.91 IC8.16 | v42.09,12.17 43.13,11.12 JP12.P$5
  Bottom 0.203: v42.09,12.17 41.66,12.6 38,12.6 35.36,9.96 31.5,9.96 26.42,15.04 26.42,16.66 v25.6,17.48
RST  (via drill 0.4)
  Top 0.203: v23.16,12.8 24.37,12.8 IC8.7 | JTAG.P$3 20.73,2.29 20.73,4.67 22.55,6.5 23.57,6.5 v24.59,7.52 24.59,7.62 24.89,7.62 25.6,6.91 26.55,6.91 R13.1 C14.2
  Bottom 0.203: v24.59,7.52 24.59,7.62 | v24.59,7.52 24.59,11.79 24.18,12.19 23.77,12.19 v23.16,12.8 | R13.1 26.59,6.88 25.64,6.88 25.09,7.42 24.99,7.52 v24.59,7.52
RXD  (via drill 0.4)
  Top 0.203: v30.89,5.28 30.68,5.49 30.68,7.52 30.68,8.33 v30.68,13.21 | v17.88,18.69 18.16,18.41 IC8.22
  Bottom 0.203: R3.2 R4.1 35.36,2.71 35.36,5.69 35.76,6.1 35.76,7.32 35.76,7.52 35.36,7.92 34.34,7.92 33.93,7.52 33.93,5.69 33.93,4.88 33.53,4.47 31.7,4.47 v30.89,5.28 | v30.68,13.21 30.07,13.21 29.87,13.41 27.64,15.65 27.64,17.88 25.81,19.71 19.51,19.71 18.49,18.69 v17.88,18.69
SCL  (via drill 0.4)
  Top 0.203: 26.72,2.03 26.82,2.03 I2C.P$1 26.82,2.23 25.2,3.86 25.2,4.67 24.79,5.08 24.59,5.28 v24.59,5.89 | v20.12,6.5 20.12,6.91 19.66,7.36 IC8.42
  Bottom 0.203: v24.59,5.89 24.38,6.1 21.13,6.1 20.52,6.1 v20.12,6.5
SDA  (via drill 0.4)
  Top 0.203: I2C.P$2 28.09,2.39 27.23,3.25 26.62,3.25 25.6,4.27 v25.6,5.89 | v21.13,6.91 20.73,6.91 20.32,7.32 20.16,7.47 IC8.43
  Bottom 0.203: v21.13,6.91 23.98,6.91 24.18,6.71 25.2,6.71 25.6,6.3 v25.6,5.89
TCK  (via drill 0.4)
  Top 0.203: 15.24,3.08 R9.2 15.44,3.76 v16.76,5.08 17.16,5.48 IC8.37 | v23.16,4.67 23.16,2.23 JTAG.P$7
  Bottom 0.203: v16.76,5.08 16.87,5.08 17.07,4.88 18.69,4.88 19.1,5.28 22.55,5.28 v23.16,4.67
TDI
  Top 0.203: R14.1 17.48,3.05 | JTAG.P$1 18.45,3.29 R14.1 | IC8.38 17.66,3.48 R14.1
TDO  (via drill 0.4)
  Top 0.203: IC8.39 18.16,6.22 v18.49,5.89 | v24.28,4.06 24.59,3.76 JTAG.P$9 24.79,2.44 v25.6,2.44
  Bottom 0.203: v18.49,5.89 19.71,5.89 19.91,5.69 22.76,5.69 23.37,5.69 24.28,4.78 v24.28,4.06 | v25.6,2.44 25.97,2.44 R6.2
TEMP  (via drill 0.4)
  Top 0.203: IC8.15 21.66,17.8 22.35,18.49 23.77,18.49 24.18,18.49 v24.59,18.09
  Bottom 0.203: JP12.P$7 43.81,8.61 42.88,9.55 42.88,9.75 42.88,10.36 41.05,12.19 38.2,12.19 35.56,9.55 31.29,9.55 26.01,14.83 24.99,15.85 24.99,16.66 24.59,17.07 v24.59,18.09
TMS  (via drill 0.4)
  Top 0.203: v16.05,6.4 16.66,7.01 16.66,9.35 17.07,9.75 17.07,10.57 16.79,10.85 IC8.34 | v21.95,4.06 22.05,3.96 JTAG.P$5
  Bottom 0.203: v21.95,4.06 21.13,4.88 19.3,4.88 18.9,4.47 17.88,4.47 | 17.78,4.37 17.88,4.47 | 17.78,4.37 17.88,4.47 | 17.78,4.37 17.88,4.47 | 17.78,4.37 16.56,4.37 15.44,3.25 R10.1 15.44,4.27 16.05,4.88 v16.05,6.4
TRST  (via drill 0.4)
  Top 0.203: v19.71,4.06 19.51,4.27 19.51,5.89 19.3,6.1 19.3,6.71 18.66,7.35 IC8.40
  Bottom 0.203: JTAG.P$4 20.78,2.79 20.73,2.85 20.73,3.66 20.32,4.06 v19.71,4.06 18.25,4.06 R25.1
TXD  (via drill 0.4)
  Top 0.203: v31.7,13.41 31.7,13.11 31.09,12.5 31.09,8.53 31.09,6.3 v32.11,5.28 | 18.69,17.13 IC8.21 18.66,19.54 v18.49,19.71
  Bottom 0.203: R5.1 37.39,2.6 37.39,7.72 36.78,8.33 34.14,8.33 33.53,7.72 33.53,5.69 33.12,5.28 v32.11,5.28 | v31.7,13.41 31.09,14.02 29.87,14.02 28.04,15.85 28.04,17.88 28.04,18.09 26.01,20.12 19.91,20.12 19.1,20.12 18.9,20.12 v18.49,19.71
USB_+5V  (via drill 0.4)
  Top 0.203: U3.PIN_1 7.64,5.77 7.32,6.1 v6.6,6.1
  Bottom 0.203: D7.3 8.36,4.57 7.64,5.28 7.11,5.28 6.6,5.79 v6.6,6.1
USB_DM  (via drill 0.4)
  Top 0.203: IC8.32 13.47,11.85 13.01,11.38 13.01,10.16 12.19,9.35 11.38,8.53 v10.77,8.53 | v9.14,8.53 7.32,8.53 6.87,8.09 R34.2
  Bottom 0.203: v10.77,8.53 9.96,8.53 v9.14,8.53 8.5,8.53 C18.1
USB_DP  (via drill 0.4)
  Top 0.203: 15.01,11.35 IC8.33 13.58,11.35 13.41,11.18 13.41,9.35 12.8,8.74 v12.8,7.32 C17.1
  Bottom 0.203: C17.1 v12.8,7.32
V_BATT  (via drill 0.4)
  Top 0.203: v23.57,16.15 23.47,16.15 22.66,16.96 IC8.13
  Bottom 0.203: JP12.P$9 43.74,6.04 42.88,6.91 42.88,7.72 42.47,8.13 42.47,8.74 42.06,9.14 42.06,9.96 40.64,11.38 38.61,11.38 35.97,8.74 30.89,8.74 25.2,14.43 23.57,16.05 v23.57,16.15

### Text on the board
Bottom: V0.1 | cc-by-sa
bStop: V0.1 | cc-by-sa